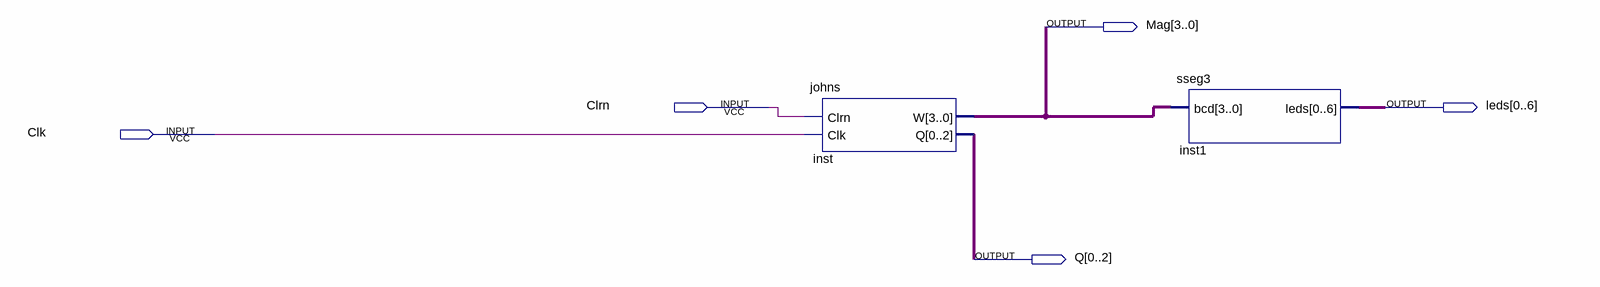
[diagram p0: schematic sheet]
// Quartus schematic johnscirc.bdf as structural Verilog: 2 symbols, 5 pins
module johnscirc (
  input  Clrn,
  input  Clk,
  output [3:0] Mag,
  output [0:6] leds,
  output [0:2] Q
);

  johns inst (.Clrn(Clrn), .Clk(Clk), .W(Mag), .Q(Q));
  sseg3 inst1 (.bcd(Mag), .leds(leds));
endmodule
